# EAGLE schematic TAMDL_V2 (EAGLE 7.3.0)

## Sheet 1 of 6
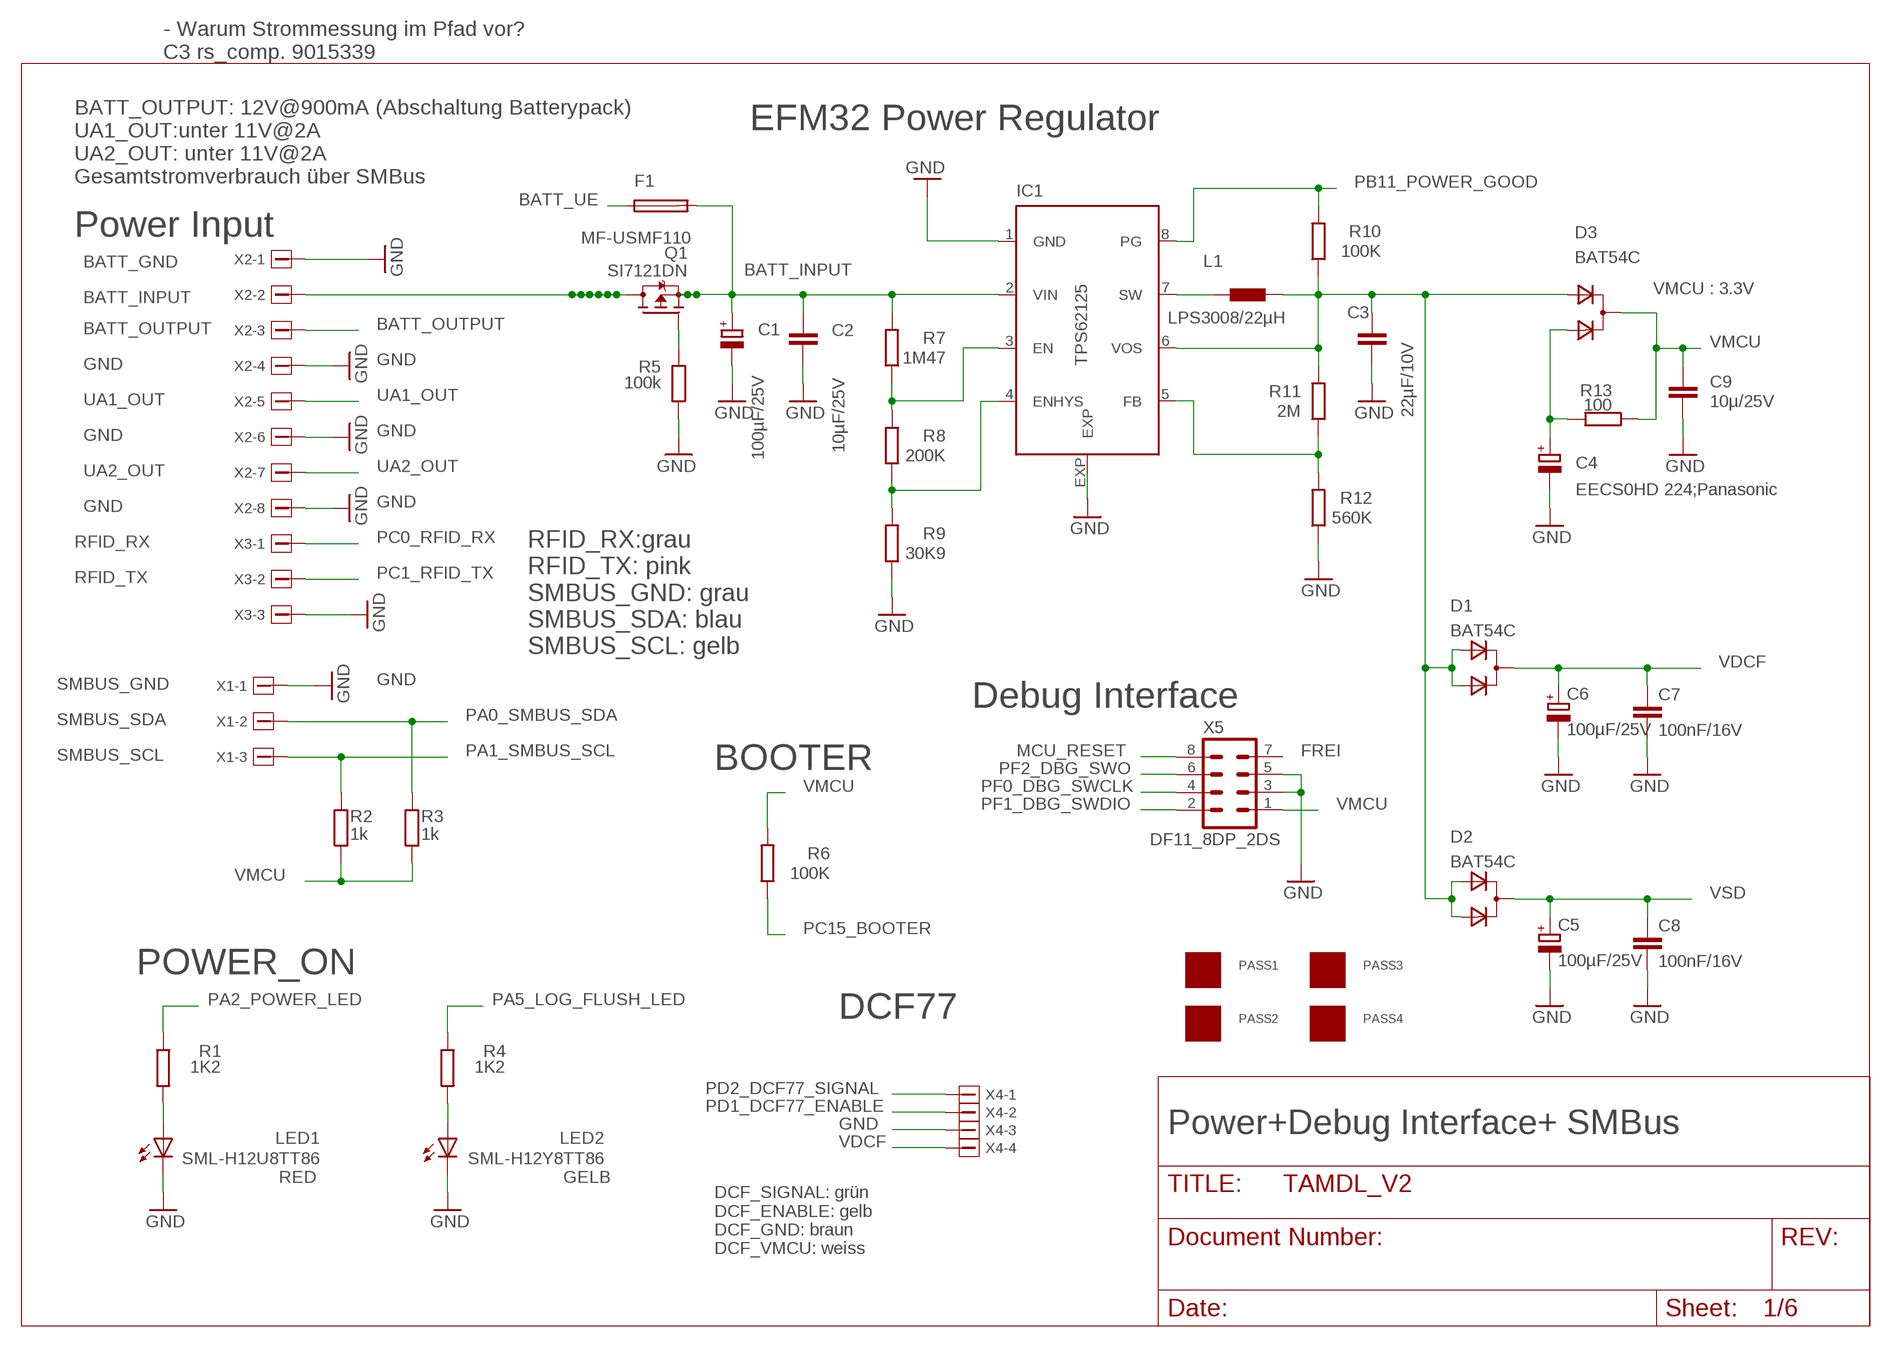
[diagram p0: schematic, sheet 1]

### Parts
C1  100µF/25V  CPOL-EUE  [PANASONIC_E]
C2  10µF/25V  C-EUC1206  [C1206]
C3  22µF/10V  C-EUC0603  [C0603]
C4  EECS0HD 224;Panasonic  GOLDCAPSPK-V  [GOLDCAPSPK-V]
C5  100µF/25V  CPOL-EUE  [PANASONIC_E]
C6  100µF/25V  CPOL-EUE  [PANASONIC_E]
C7  100nF/16V  C-EUC0805  [C0805]
C8  100nF/16V  C-EUC0805  [C0805]
C9  10µ/25V  C-EUC1206  [C1206]
D1  BAT54C  D2A_SOT23  [SOT-23$1]
D2  BAT54C  D2A_SOT23  [SOT-23$1]
D3  BAT54C  D2A_SOT23  [SOT-23$1]
F1  MF-USMF110  PFUF  [PFUF_1210POLY]
IC1  TPS62125  [DSG_PWSO-N8_EXP]
L1  LPS3008/22µH  LPS3008  [LPS3008]
LED1  SML-H12U8TT86  LEDCHIPLED_0805  [CHIPLED_0805]
LED2  SML-H12Y8TT86  LEDCHIPLED_0805  [CHIPLED_0805]
PASS1  ROUND_1MM1.5  [ROUND2_1.5MM]
PASS2  ROUND_1MM1.5  [ROUND2_1.5MM]
PASS3  ROUND_1MM1.5  [ROUND2_1.5MM]
PASS4  ROUND_1MM1.5  [ROUND2_1.5MM]
Q1  SI7121DN  TRANSISTOR-FET_SI7113DN  [TRANSISTOR-FET_1212-8S]
R1  1K2  R-EU_R0805  [R0805]
R2  1k  R-EU_R0805  [R0805]
R3  1k  R-EU_R0805  [R0805]
R4  1K2  R-EU_R0805  [R0805]
R5  100k  R-EU_R0805  [R0805]
R6  100K  R-EU_R0805  [R0805]
R7  1M47  R-EU_R0805  [R0805]
R8  200K  R-EU_R0805  [R0805]
R9  30K9  R-EU_R0805  [R0805]
R10  100K  R-EU_R0805  [R0805]
R11  2M  R-EU_R0805  [R0805]
R12  560K  R-EU_R0805  [R0805]
R13  100  R-EU_R0805  [R0805]
X1  1803439  [1803439]
X2  1803484  [1803484]
X3  1803439  [1803439]
X4  1803442  [1803442]
X5  DF11_8DP_2DS  DP11_8DP_2DS  [DP11_8DP-2DS]

### Nets
1: C3.1 D1.2(A1) D1.3(A2) D2.2(A1) D2.3(A2) D3.2(A1) IC1.6(VOS) L1.2 R10.1 R11.2
BAT+: Q1.5(D) Q1.6(D) Q1.7(D) Q1.8(D) Q1.9(D) Q1.10(D) Q1.11(D) X2.2
BATT_INPUT: C1.+ C2.1 F1.P$2 IC1.2(VIN) Q1.1(S) Q1.2(S) Q1.3(S) R7.2 ; also sheet 4
BATT_OUTPUT: X2.3 ; also sheet 5
BATT_UE: F1.P$1 ; also sheet 5
GND: C1.- C2.2 C3.2 C4.- C5.- C6.- C7.2 C8.2 C9.1 IC1.1(GND) IC1.EXP LED1.C LED2.C R5.1 R9.1 R12.1 X1.1 X2.1 X2.4 X2.6 X2.8 X3.3 X4.3 X5.3 X5.5 ; also sheet 2,3,4,5,6
MCU_RESET: X5.8 ; also sheet 2,3
N$3: LED1.A R1.2
N$4: C4.+ D3.3(A2) R13.2
N$5: LED2.A R4.2
N$6: IC1.3(EN) R7.1 R8.2
N$8: IC1.4(ENHYS) R8.1 R9.2
N$9: IC1.7(SW) L1.1
N$10: IC1.5(FB) R11.1 R12.2
N$20: Q1.4(G) R5.2
PA0_SMBUS_SDA: R3.2 X1.2 ; also sheet 2
PA1_SMBUS_SCL: R2.2 X1.3 ; also sheet 2
PA2_POWER_LED: R1.1 ; also sheet 2
PA5_LOG_FLUSH_LED: R4.1 ; also sheet 2
PB11_POWER_GOOD: IC1.8(PG) R10.2 ; also sheet 2
PC0_RFID_RX: X3.1 ; also sheet 2
PC1_RFID_TX: X3.2 ; also sheet 2
PC15_BOOTER: R6.1 ; also sheet 2
PD1_DCF77_ENABLE: X4.2 ; also sheet 2
PD2_DCF77_SIGNAL: X4.1 ; also sheet 2
PF0_DBG_SWCLK: X5.4 ; also sheet 2
PF1_DBG_SWDIO: X5.2 ; also sheet 2
PF2_DBG_SWO: X5.6 ; also sheet 2
UA1_OUT: X2.5 ; also sheet 4
UA2_OUT: X2.7 ; also sheet 4
VDCF: C6.+ C7.1 D1.1(C) X4.4
VMCU: C9.2 D3.1(C) R2.1 R3.1 R6.2 R13.1 X5.1 ; also sheet 2,3,6
VSD: C5.+ C8.1 D2.1(C) ; also sheet 3
Unconnected: X5.7

### Notes on the sheet
- - Warum Strommessung im Pfad vor?
  C3 rs_comp. 9015339
- EFM32 Power Regulator
- BATT_OUTPUT: 12V@900mA (Abschaltung Batterypack)
  UA1_OUT:unter 11V@2A
  UA2_OUT: unter 11V@2A
  Gesamtstromverbrauch über SMBus
- Power Input
- BATT_GND
- VMCU : 3.3V
- BATT_INPUT
- BATT_OUTPUT
- GND
- UA1_OUT
- GND
- UA2_OUT
- GND
- RFID_RX
- RFID_TX
- RFID_RX:grau
  RFID_TX: pink
  SMBUS_GND: grau
  SMBUS_SDA: blau
  SMBUS_SCL: gelb
- SMBUS_GND
- Debug Interface
- SMBUS_SDA
- SMBUS_SCL | FREI
- BOOTER
- POWER_ON
- DCF77
- Power+Debug Interface+ SMBus
- RED | GELB
- DCF_SIGNAL: grün
  DCF_ENABLE: gelb
  DCF_GND: braun
  DCF_VMCU: weiss

## Sheet 2 of 6
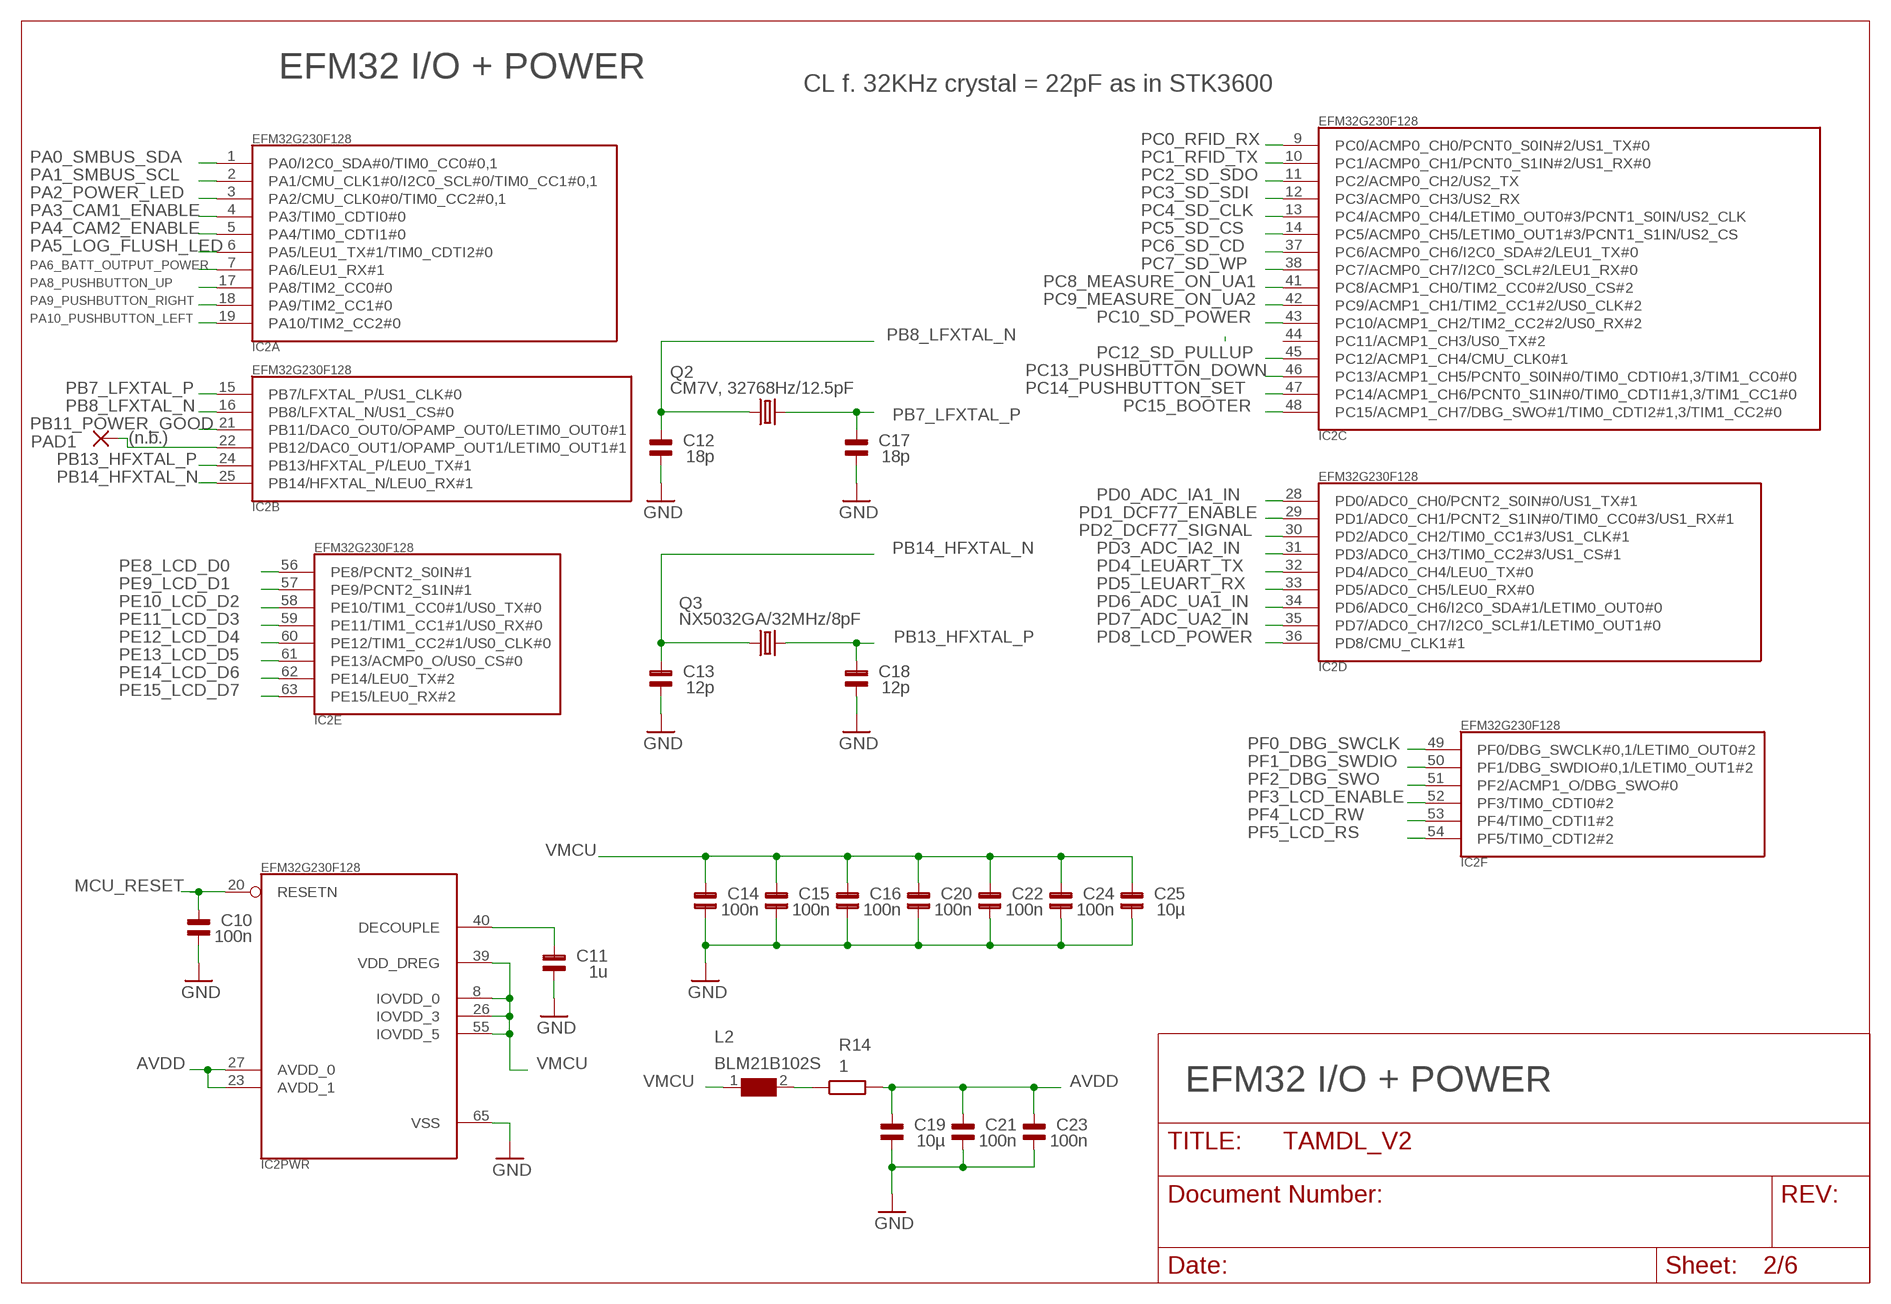
[diagram p1: schematic, sheet 2]

### Parts
C10  100n  C_SMD0805  [0805]
C11  1u  C_SMD0805  [0805]
C12  18p  C_SMD0805  [0805]
C13  12p  C_SMD0805  [0805]
C14  100n  C_SMD0805  [0805]
C15  100n  C_SMD0805  [0805]
C16  100n  C_SMD0805  [0805]
C17  18p  C_SMD0805  [0805]
C18  12p  C_SMD0805  [0805]
C19  10µ  C_SMD0805  [0805]
C20  100n  C_SMD0805  [0805]
C21  100n  C_SMD0805  [0805]
C22  100n  C_SMD0805  [0805]
C23  100n  C_SMD0805  [0805]
C24  100n  C_SMD0805  [0805]
C25  10µ  C_SMD0805  [0805]
IC2  EFM32G230F128  [QFN64]
L2  BLM21B102S  WE-CBF-7427920_0805  [0805]
PAD1  (n.b.)  SMD2  [SMD1,27-2,54]
Q2  CM7V, 32768Hz/12.5pF  CRYSTAL2P  [CRYSTAL2P3.2X1.5]
Q3  NX5032GA/32MHz/8pF  CRYSTAL2P5.0X3.2  [CRYSTAL2P5.0X3.2]
R14  1  R-EU_R0805  [R0805]

### Nets
AVDD [VCC]: C19.2 C21.2 C23.2 IC2.23(PWR:AVDD_1) IC2.27(PWR:AVDD_0) R14.2
GND: C10.1 C11.1 C12.1 C13.1 C14.1 C15.1 C16.1 C17.1 C18.1 C19.1 C20.1 C21.1 C22.1 C23.1 C24.1 C25.1 IC2.65(PWR:VSS) ; also sheet 1,3,4,5,6
MCU_RESET: C10.2 IC2.20(PWR:RESETN) ; also sheet 1,3
N$14: L2.2 R14.1
N$21: IC2.22(B:PB12/DAC0_OUT1/OPAMP_OUT1/LETIM0_OUT1#1) PAD1.1(P)
N$30: C11.2 IC2.40(PWR:DECOUPLE)
PA0_SMBUS_SDA: IC2.1(A:PA0/I2C0_SDA#0/TIM0_CC0#0,1) ; also sheet 1
PA1_SMBUS_SCL: IC2.2(A:PA1/CMU_CLK1#0/I2C0_SCL#0/TIM0_CC1#0,1) ; also sheet 1
PA2_POWER_LED: IC2.3(A:PA2/CMU_CLK0#0/TIM0_CC2#0,1) ; also sheet 1
PA3_CAM1_ENABLE: IC2.4(A:PA3/TIM0_CDTI0#0) ; also sheet 4
PA4_CAM2_ENABLE: IC2.5(A:PA4/TIM0_CDTI1#0) ; also sheet 4
PA5_LOG_FLUSH_LED: IC2.6(A:PA5/LEU1_TX#1/TIM0_CDTI2#0) ; also sheet 1
PA6_BATT_OUTPUT_POWER: IC2.7(A:PA6/LEU1_RX#1) ; also sheet 5
PA8_PUSHBUTTON_UP: IC2.17(A:PA8/TIM2_CC0#0) ; also sheet 3
PA9_PUSHBUTTON_RIGHT: IC2.18(A:PA9/TIM2_CC1#0) ; also sheet 3
PA10_PUSHBUTTON_LEFT: IC2.19(A:PA10/TIM2_CC2#0) ; also sheet 3
PB7_LFXTAL_P: C17.2 IC2.15(B:PB7/LFXTAL_P/US1_CLK#0) Q2.2
PB8_LFXTAL_N: C12.2 IC2.16(B:PB8/LFXTAL_N/US1_CS#0) Q2.1
PB11_POWER_GOOD: IC2.21(B:PB11/DAC0_OUT0/OPAMP_OUT0/LETIM0_OUT0#1) ; also sheet 1
PB13_HFXTAL_P: C18.2 IC2.24(B:PB13/HFXTAL_P/LEU0_TX#1) Q3.2
PB14_HFXTAL_N: C13.2 IC2.25(B:PB14/HFXTAL_N/LEU0_RX#1) Q3.1
PC0_RFID_RX: IC2.9(C:PC0/ACMP0_CH0/PCNT0_S0IN#2/US1_TX#0) ; also sheet 1
PC1_RFID_TX: IC2.10(C:PC1/ACMP0_CH1/PCNT0_S1IN#2/US1_RX#0) ; also sheet 1
PC2_SD_SDO: IC2.11(C:PC2/ACMP0_CH2/US2_TX) ; also sheet 3
PC3_SD_SDI: IC2.12(C:PC3/ACMP0_CH3/US2_RX) ; also sheet 3
PC4_SD_CLK: IC2.13(C:PC4/ACMP0_CH4/LETIM0_OUT0#3/PCNT1_S0IN/US2_CLK) ; also sheet 3
PC5_SD_CS: IC2.14(C:PC5/ACMP0_CH5/LETIM0_OUT1#3/PCNT1_S1IN/US2_CS) ; also sheet 3
PC6_SD_CD: IC2.37(C:PC6/ACMP0_CH6/I2C0_SDA#2/LEU1_TX#0) ; also sheet 3
PC7_SD_WP: IC2.38(C:PC7/ACMP0_CH7/I2C0_SCL#2/LEU1_RX#0) ; also sheet 3
PC8_MEASURE_ON_UA1: IC2.41(C:PC8/ACMP1_CH0/TIM2_CC0#2/US0_CS#2) ; also sheet 5
PC9_MEASURE_ON_UA2: IC2.42(C:PC9/ACMP1_CH1/TIM2_CC1#2/US0_CLK#2) ; also sheet 5
PC10_SD_POWER: IC2.43(C:PC10/ACMP1_CH2/TIM2_CC2#2/US0_RX#2) ; also sheet 3
PC12_SD_PULLUP: IC2.45(C:PC12/ACMP1_CH4/CMU_CLK0#1) ; also sheet 3
PC13_PUSHBUTTON_DOWN: IC2.46(C:PC13/ACMP1_CH5/PCNT0_S0IN#0/TIM0_CDTI0#1,3/TIM1_CC0#0) ; also sheet 3
PC14_PUSHBUTTON_SET: IC2.47(C:PC14/ACMP1_CH6/PCNT0_S1IN#0/TIM0_CDTI1#1,3/TIM1_CC1#0) ; also sheet 3
PC15_BOOTER: IC2.48(C:PC15/ACMP1_CH7/DBG_SWO#1/TIM0_CDTI2#1,3/TIM1_CC2#0) ; also sheet 1
PD0_ADC_IA1_IN: IC2.28(D:PD0/ADC0_CH0/PCNT2_S0IN#0/US1_TX#1) ; also sheet 5
PD1_DCF77_ENABLE: IC2.29(D:PD1/ADC0_CH1/PCNT2_S1IN#0/TIM0_CC0#3/US1_RX#1) ; also sheet 1
PD2_DCF77_SIGNAL: IC2.30(D:PD2/ADC0_CH2/TIM0_CC1#3/US1_CLK#1) ; also sheet 1
PD3_ADC_IA2_IN: IC2.31(D:PD3/ADC0_CH3/TIM0_CC2#3/US1_CS#1) ; also sheet 5
PD4_LEUART_TX: IC2.32(D:PD4/ADC0_CH4/LEU0_TX#0) ; also sheet 3
PD5_LEUART_RX: IC2.33(D:PD5/ADC0_CH5/LEU0_RX#0) ; also sheet 3
PD6_ADC_UA1_IN: IC2.34(D:PD6/ADC0_CH6/I2C0_SDA#1/LETIM0_OUT0#0) ; also sheet 5
PD7_ADC_UA2_IN: IC2.35(D:PD7/ADC0_CH7/I2C0_SCL#1/LETIM0_OUT1#0) ; also sheet 5
PD8_LCD_POWER: IC2.36(D:PD8/CMU_CLK1#1) ; also sheet 6
PE8_LCD_D0: IC2.56(E:PE8/PCNT2_S0IN#1) ; also sheet 6
PE9_LCD_D1: IC2.57(E:PE9/PCNT2_S1IN#1) ; also sheet 6
PE10_LCD_D2: IC2.58(E:PE10/TIM1_CC0#1/US0_TX#0) ; also sheet 6
PE11_LCD_D3: IC2.59(E:PE11/TIM1_CC1#1/US0_RX#0) ; also sheet 6
PE12_LCD_D4: IC2.60(E:PE12/TIM1_CC2#1/US0_CLK#0) ; also sheet 6
PE13_LCD_D5: IC2.61(E:PE13/ACMP0_O/US0_CS#0) ; also sheet 6
PE14_LCD_D6: IC2.62(E:PE14/LEU0_TX#2) ; also sheet 6
PE15_LCD_D7: IC2.63(E:PE15/LEU0_RX#2) ; also sheet 6
PF0_DBG_SWCLK: IC2.49(F:PF0/DBG_SWCLK#0,1/LETIM0_OUT0#2) ; also sheet 1
PF1_DBG_SWDIO: IC2.50(F:PF1/DBG_SWDIO#0,1/LETIM0_OUT1#2) ; also sheet 1
PF2_DBG_SWO: IC2.51(F:PF2/ACMP1_O/DBG_SWO#0) ; also sheet 1
PF3_LCD_ENABLE: IC2.52(F:PF3/TIM0_CDTI0#2) ; also sheet 6
PF4_LCD_RW: IC2.53(F:PF4/TIM0_CDTI1#2) ; also sheet 6
PF5_LCD_RS: IC2.54(F:PF5/TIM0_CDTI2#2) ; also sheet 6
VMCU: C14.2 C15.2 C16.2 C20.2 C22.2 C24.2 C25.2 IC2.8(PWR:IOVDD_0) IC2.26(PWR:IOVDD_3) IC2.39(PWR:VDD_DREG) IC2.55(PWR:IOVDD_5) L2.1 ; also sheet 1,3,6
Unconnected: IC2.44(C:PC11/ACMP1_CH3/US0_TX#2)

### Notes on the sheet
- EFM32 I/O + POWER
- CL f. 32KHz crystal = 22pF as in STK3600
- EFM32 I/O + POWER

## Sheet 3 of 6
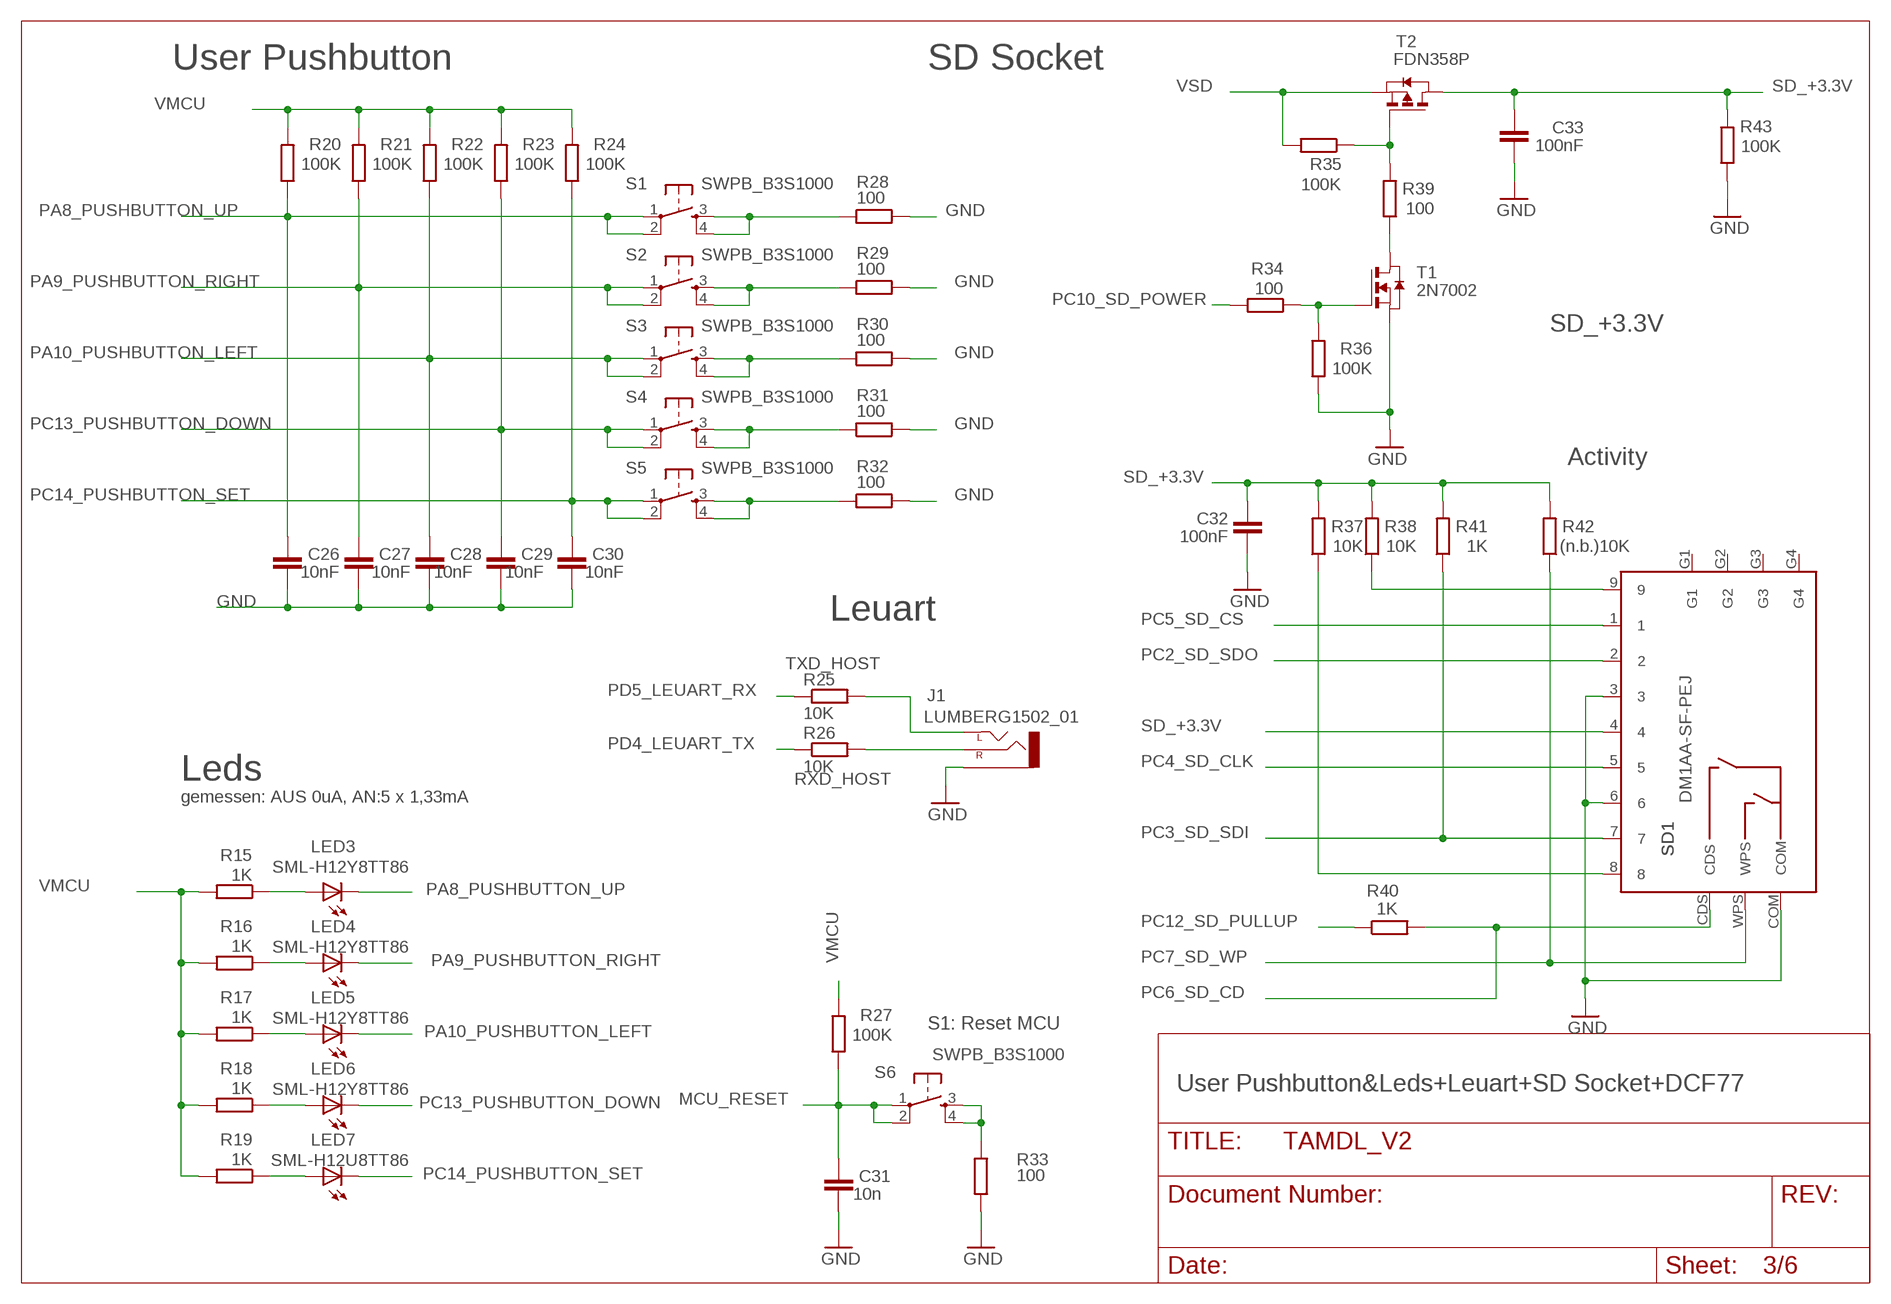
[diagram p2: schematic, sheet 3]

### Parts
C26  10nF  C-EUC0603  [C0603]
C27  10nF  C-EUC0603  [C0603]
C28  10nF  C-EUC0603  [C0603]
C29  10nF  C-EUC0603  [C0603]
C30  10nF  C-EUC0603  [C0603]
C31  10n  C-EUC0603  [C0603]
C32  100nF  C-EUC0603  [C0603]
C33  100nF  C-EUC0603  [C0603]
J1  LUMBERG1502_01  [LUMBERG1502_01]
LED3  SML-H12Y8TT86  LEDCHIPLED_0805  [CHIPLED_0805]
LED4  SML-H12Y8TT86  LEDCHIPLED_0805  [CHIPLED_0805]
LED5  SML-H12Y8TT86  LEDCHIPLED_0805  [CHIPLED_0805]
LED6  SML-H12Y8TT86  LEDCHIPLED_0805  [CHIPLED_0805]
LED7  SML-H12U8TT86  LEDCHIPLED_0805  [CHIPLED_0805]
R15  1K  R-EU_R0805  [R0805]
R16  1K  R-EU_R0805  [R0805]
R17  1K  R-EU_R0805  [R0805]
R18  1K  R-EU_R0805  [R0805]
R19  1K  R-EU_R0805  [R0805]
R20  100K  R-EU_R0805  [R0805]
R21  100K  R-EU_R0805  [R0805]
R22  100K  R-EU_R0805  [R0805]
R23  100K  R-EU_R0805  [R0805]
R24  100K  R-EU_R0805  [R0805]
R25  10K  R-EU_R0805  [R0805]
R26  10K  R-EU_R0805  [R0805]
R27  100K  R-EU_R0805  [R0805]
R28  100  R-EU_R0805  [R0805]
R29  100  R-EU_R0805  [R0805]
R30  100  R-EU_R0805  [R0805]
R31  100  R-EU_R0805  [R0805]
R32  100  R-EU_R0805  [R0805]
R33  100  R-EU_R0805  [R0805]
R34  100  R-EU_R0805  [R0805]
R35  100K  R-EU_R0805  [R0805]
R36  100K  R-EU_R0805  [R0805]
R37  10K  R-EU_R0805  [R0805]
R38  10K  R-EU_R0805  [R0805]
R39  100  R-EU_R0805  [R0805]
R40  1K  R-EU_R0805  [R0805]
R41  1K  R-EU_R0805  [R0805]
R42  (n.b.)10K  R-EU_R0805  [R0805]
R43  100K  R-EU_R0805  [R0805]
S1  SWPB_B3S1000  DTSM-6  [DTSM-6]
S2  SWPB_B3S1000  DTSM-6  [DTSM-6]
S3  SWPB_B3S1000  DTSM-6  [DTSM-6]
S4  SWPB_B3S1000  DTSM-6  [DTSM-6]
S5  SWPB_B3S1000  DTSM-6  [DTSM-6]
S6  SWPB_B3S1000  DTSM-6  [DTSM-6]
SD1  DM1AA-SF-PEJ  [DM1AA-SF-PEJ]
T1  2N7002  ZETEX_NMOSSOT23  [ZETEX_SOT-23]
T2  FDN358P  ZETEX_PMOSSOT23  [ZETEX_SOT-23]

### Nets
GND: C26.1 C27.1 C28.1 C29.1 C30.1 C31.1 C32.2 C33.2 J1.P$1(1-SLEEVE) R28.2 R29.2 R30.2 R31.2 R32.2 R33.2 R36.1 R43.1 SD1.3 SD1.6 SD1.COM T1.2(S) ; also sheet 1,2,4,5,6
MCU_RESET: C31.2 R27.1 S6.1 S6.2 ; also sheet 1,2
N$1: R33.1 S6.3 S6.4
N$12: R38.1 SD1.9
N$13: R37.1 SD1.8
N$22: LED3.A R15.1
N$23: R28.1 S1.3 S1.4
N$24: R29.1 S2.3 S2.4
N$26: R30.1 S3.3 S3.4
N$27: R31.1 S4.3 S4.4
N$28: R32.1 S5.3 S5.4
N$29: LED4.A R16.1
N$41: R35.1 R39.2 T2.3(G)
N$43: R39.1 T1.1(D)
N$47: R34.1 R36.2 T1.3(G)
N$52: LED5.A R17.1
N$68: LED6.A R18.1
N$71: LED7.A R19.1
PA8_PUSHBUTTON_UP: C26.2 LED3.C R20.1 S1.1 S1.2 ; also sheet 2
PA9_PUSHBUTTON_RIGHT: C27.2 LED4.C R21.1 S2.1 S2.2 ; also sheet 2
PA10_PUSHBUTTON_LEFT: C28.2 LED5.C R22.1 S3.1 S3.2 ; also sheet 2
PC2_SD_SDO: SD1.2 ; also sheet 2
PC3_SD_SDI: R41.1 SD1.7 ; also sheet 2
PC4_SD_CLK: SD1.5 ; also sheet 2
PC5_SD_CS: SD1.1 ; also sheet 2
PC6_SD_CD: R40.2 SD1.CDS ; also sheet 2
PC7_SD_WP: R42.1 SD1.WPS ; also sheet 2
PC10_SD_POWER: R34.2 ; also sheet 2
PC12_SD_PULLUP: R40.1 ; also sheet 2
PC13_PUSHBUTTON_DOWN: C29.2 LED6.C R23.1 S4.1 S4.2 ; also sheet 2
PC14_PUSHBUTTON_SET: C30.2 LED7.C R24.1 S5.1 S5.2 ; also sheet 2
PD4_LEUART_TX: R26.1 ; also sheet 2
PD5_LEUART_RX: R25.1 ; also sheet 2
RXD_HOST: J1.P$3(3-RIGHT) R26.2
SD_+3.3V: C32.1 C33.1 R37.2 R38.2 R41.2 R42.2 R43.2 SD1.4 T2.1(D)
TXD_HOST: J1.P$2(2-LEFT) R25.2
VMCU: R15.2 R16.2 R17.2 R18.2 R19.2 R20.2 R21.2 R22.2 R23.2 R24.2 R27.2 ; also sheet 1,2,6
VSD: R35.2 T2.2(S) ; also sheet 1
Unconnected: SD1.G1 SD1.G2 SD1.G3 SD1.G4

### Notes on the sheet
- User Pushbutton | SD Socket
- SD_+3.3V
- Activity
- Leuart
- Leds
- gemessen: AUS 0uA, AN:5 x 1,33mA
- S1: Reset MCU
- User Pushbutton&Leds+Leuart+SD Socket+DCF77

## Sheet 4 of 6
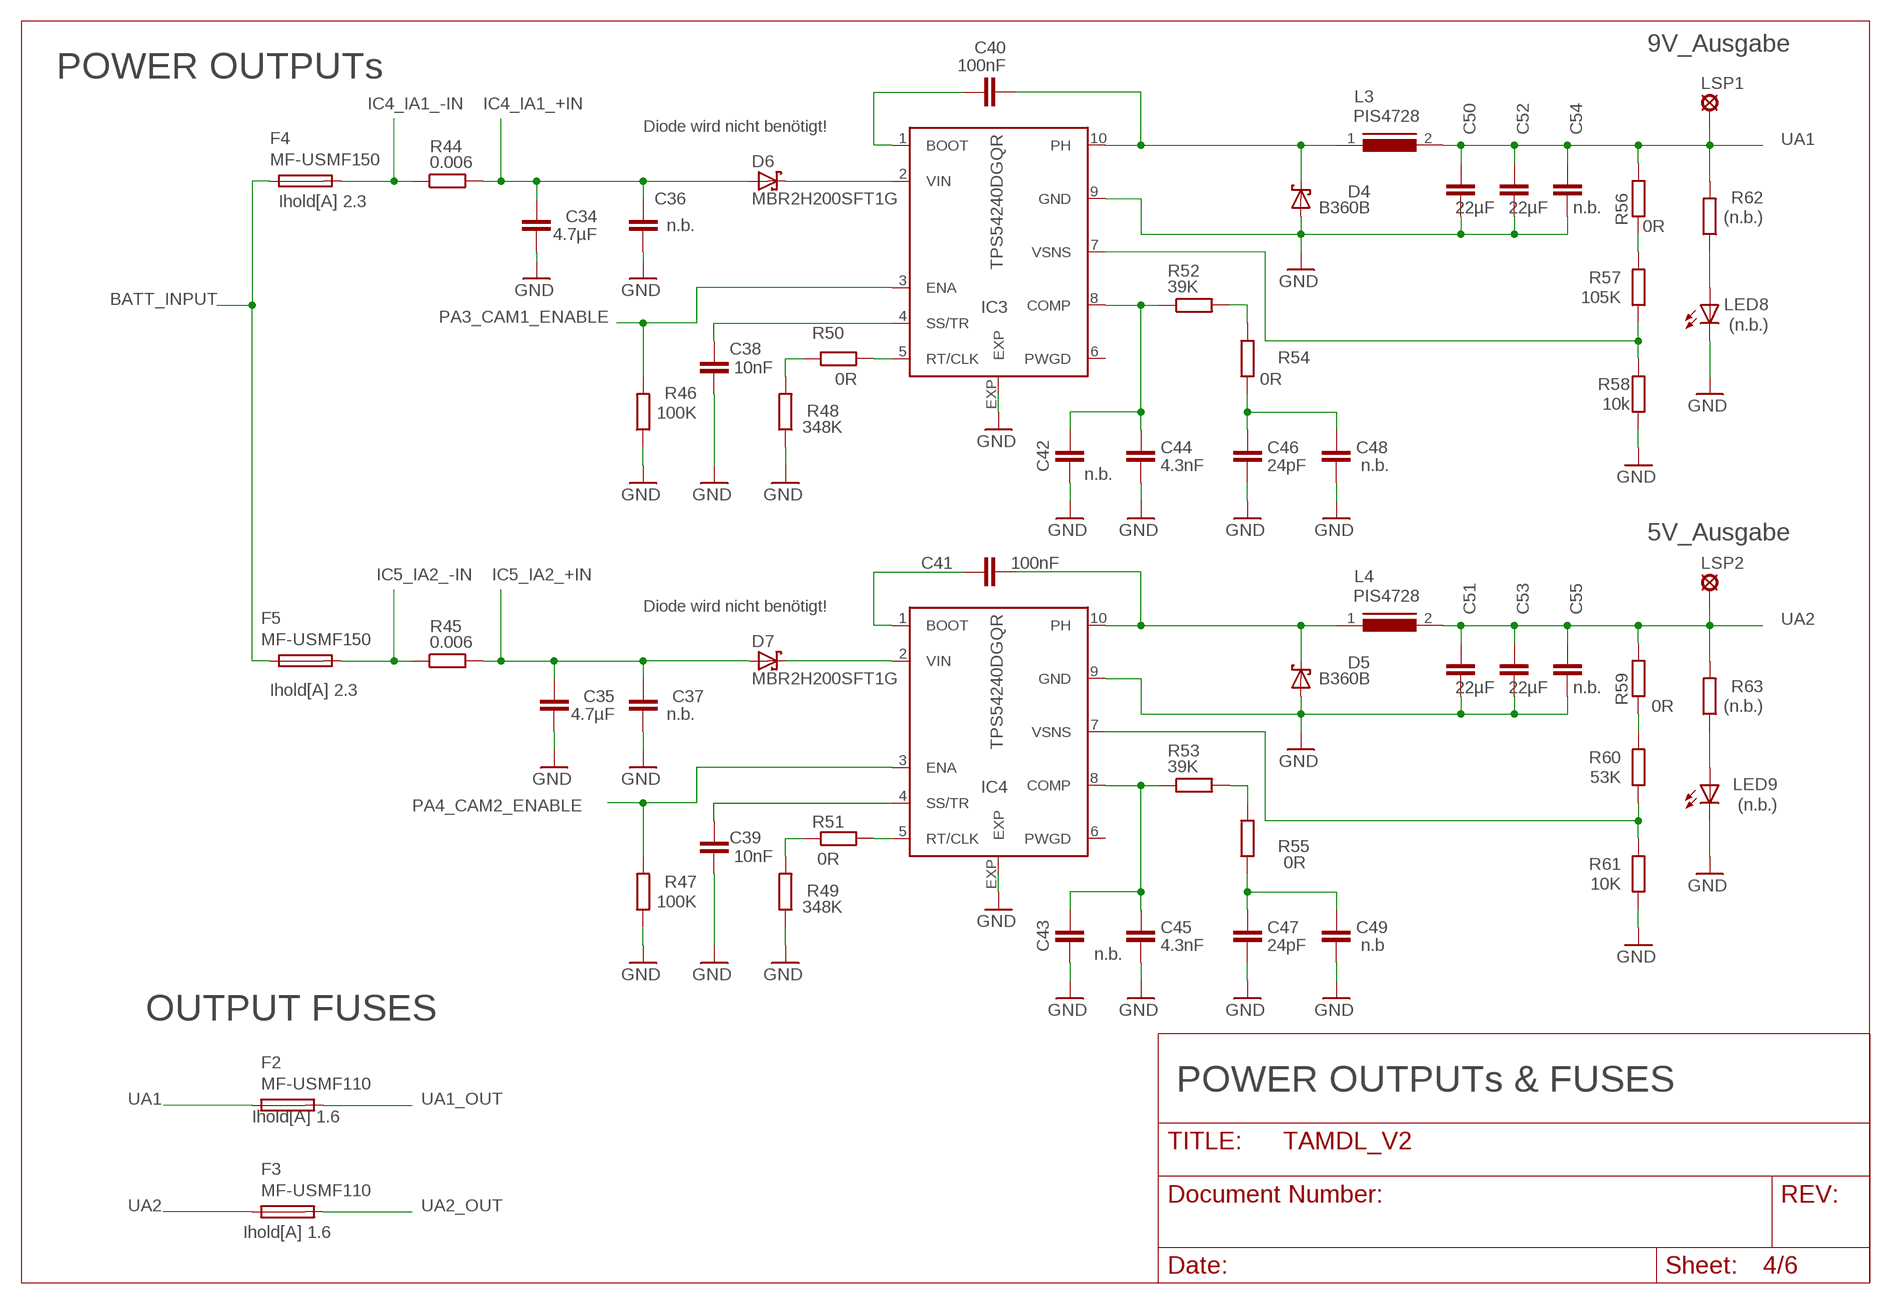
[diagram p3: schematic, sheet 4]

### Parts
C34  4.7µF  C-EUC1210  [C1210]
C35  4.7µF  C-EUC1210  [C1210]
C36  n.b.  C-EUC1210  [C1210]
C37  n.b.  C-EUC1210  [C1210]
C38  10nF  C-EUC0603  [C0603]
C39  10nF  C-EUC0603  [C0603]
C40  100nF  C-EUC0603  [C0603]
C41  100nF  C-EUC0603  [C0603]
C42  n.b.  C-EUC0603  [C0603]
C43  n.b.  C-EUC0603  [C0603]
C44  4.3nF  C-EUC0603  [C0603]
C45  4.3nF  C-EUC0603  [C0603]
C46  24pF  C-EUC0603  [C0603]
C47  24pF  C-EUC0603  [C0603]
C48  n.b.  C-EUC0603  [C0603]
C49  n.b  C-EUC0603  [C0603]
C50  22µF  C-EUC1210  [C1210]
C51  22µF  C-EUC1210  [C1210]
C52  22µF  C-EUC1210  [C1210]
C53  22µF  C-EUC1210  [C1210]
C54  n.b.  C-EUC1210  [C1210]
C55  n.b.  C-EUC1210  [C1210]
D4  B360B  SCHOTTKY-DIODESMD  [SMB]
D5  B360B  SCHOTTKY-DIODESMD  [SMB]
D6  MBR2H200SFT1G  SMF5.0AT1  [SOD123FL]
D7  MBR2H200SFT1G  SMF5.0AT1  [SOD123FL]
F2  MF-USMF110  PFUF  [PFUF_1210POLY]
F3  MF-USMF110  PFUF  [PFUF_1210POLY]
F4  MF-USMF150  PFUF  [PFUF_1210POLY]
F5  MF-USMF150  PFUF  [PFUF_1210POLY]
IC3  TPS54240DGQR  [S-PDSO-G10]
IC4  TPS54240DGQR  [S-PDSO-G10]
L3  PIS4728  DR127  [DR127]
L4  PIS4728  DR127  [DR127]
LED8  (n.b.)  LEDCHIPLED_0805  [CHIPLED_0805]
LED9  (n.b.)  LEDCHIPLED_0805  [CHIPLED_0805]
LSP1  (n.b.)SE13  SE13  [SE13]
LSP2  (n.b.)SE13  SE13  [SE13]
R44  0.006  R-EU_R2512W  [R2512W]
R45  0.006  R-EU_R2512W  [R2512W]
R46  100K  R-EU_R0805  [R0805]
R47  100K  R-EU_R0805  [R0805]
R48  348K  R-EU_R0805  [R0805]
R49  348K  R-EU_R0805  [R0805]
R50  0R  R-EU_R0805  [R0805]
R51  0R  R-EU_R0805  [R0805]
R52  39K  R-EU_R0805  [R0805]
R53  39K  R-EU_R0805  [R0805]
R54  0R  R-EU_R0805  [R0805]
R55  0R  R-EU_R0805  [R0805]
R56  0R  R-EU_R0805  [R0805]
R57  105K  R-EU_R0805  [R0805]
R58  10k  R-EU_R0805  [R0805]
R59  0R  R-EU_R0805  [R0805]
R60  53K  R-EU_R0805  [R0805]
R61  10K  R-EU_R0805  [R0805]
R62  (n.b.)  R-EU_R0805  [R0805]
R63  (n.b.)  R-EU_R0805  [R0805]

### Nets
BATT_INPUT: F4.P$1 F5.P$1 ; also sheet 1
GND: C34.2 C35.2 C36.2 C37.2 C38.2 C39.2 C42.2 C43.2 C44.2 C45.2 C46.2 C47.2 C48.2 C49.2 C50.2 C51.2 C52.2 C53.2 C54.2 C55.2 D4.A D5.A IC3.9(GND) IC3.EXP IC4.9(GND) IC4.EXP LED8.C LED9.C R46.1 R47.1 R48.1 R49.1 R58.1 R61.1 ; also sheet 1,2,3,5,6
IC4_IA1_+IN: C34.1 C36.1 D6.A R44.2 ; also sheet 5
IC4_IA1_-IN: F4.P$2 R44.1 ; also sheet 5
IC5_IA2_+IN: C35.1 C37.1 D7.A R45.2 ; also sheet 5
IC5_IA2_-IN: F5.P$2 R45.1 ; also sheet 5
N$2: C40.2 IC3.1(BOOT)
N$7: C40.1 D4.C IC3.10(PH) L3.1
N$15: C38.1 IC3.4(SS/TR)
N$16: C42.1 C44.1 IC3.8(COMP) R52.1
N$36: C46.1 C48.1 R54.1
N$38: IC3.7(VSNS) R57.1 R58.2
N$42: C41.2 IC4.1(BOOT)
N$45: C41.1 D5.C IC4.10(PH) L4.1
N$55: C39.1 IC4.4(SS/TR)
N$56: C43.1 C45.1 IC4.8(COMP) R53.1
N$57: C47.1 C49.1 R55.1
N$58: IC4.7(VSNS) R60.1 R61.2
N$59: LED9.A R63.1
N$61: R48.2 R50.1
N$62: D6.C IC3.2(VIN)
N$63: R49.2 R51.1
N$64: IC3.5(RT/CLK) R50.2
N$65: R52.2 R54.2
N$66: R56.1 R57.2
N$67: IC4.5(RT/CLK) R51.2
N$69: R59.1 R60.2
N$70: R53.2 R55.2
N$72: D7.C IC4.2(VIN)
N$73: LED8.A R62.1
PA3_CAM1_ENABLE: IC3.3(ENA) R46.2 ; also sheet 2
PA4_CAM2_ENABLE: IC4.3(ENA) R47.2 ; also sheet 2
UA1: C50.1 C52.1 C54.1 F2.P$1 L3.2 LSP1.MP R56.2 R62.2 ; also sheet 5
UA1_OUT: F2.P$2 ; also sheet 1
UA2: C51.1 C53.1 C55.1 F3.P$1 L4.2 LSP2.MP R59.2 R63.2 ; also sheet 5
UA2_OUT: F3.P$2 ; also sheet 1
Unconnected: IC3.6(PWGD) IC4.6(PWGD)

### Notes on the sheet
- 9V_Ausgabe
- POWER OUTPUTs
- Diode wird nicht benötigt!
- Ihold[A] 2.3
- 5V_Ausgabe
- Diode wird nicht benötigt!
- Ihold[A] 2.3
- OUTPUT FUSES
- POWER OUTPUTs & FUSES
- Ihold[A] 1.6
- Ihold[A] 1.6

## Sheet 5 of 6
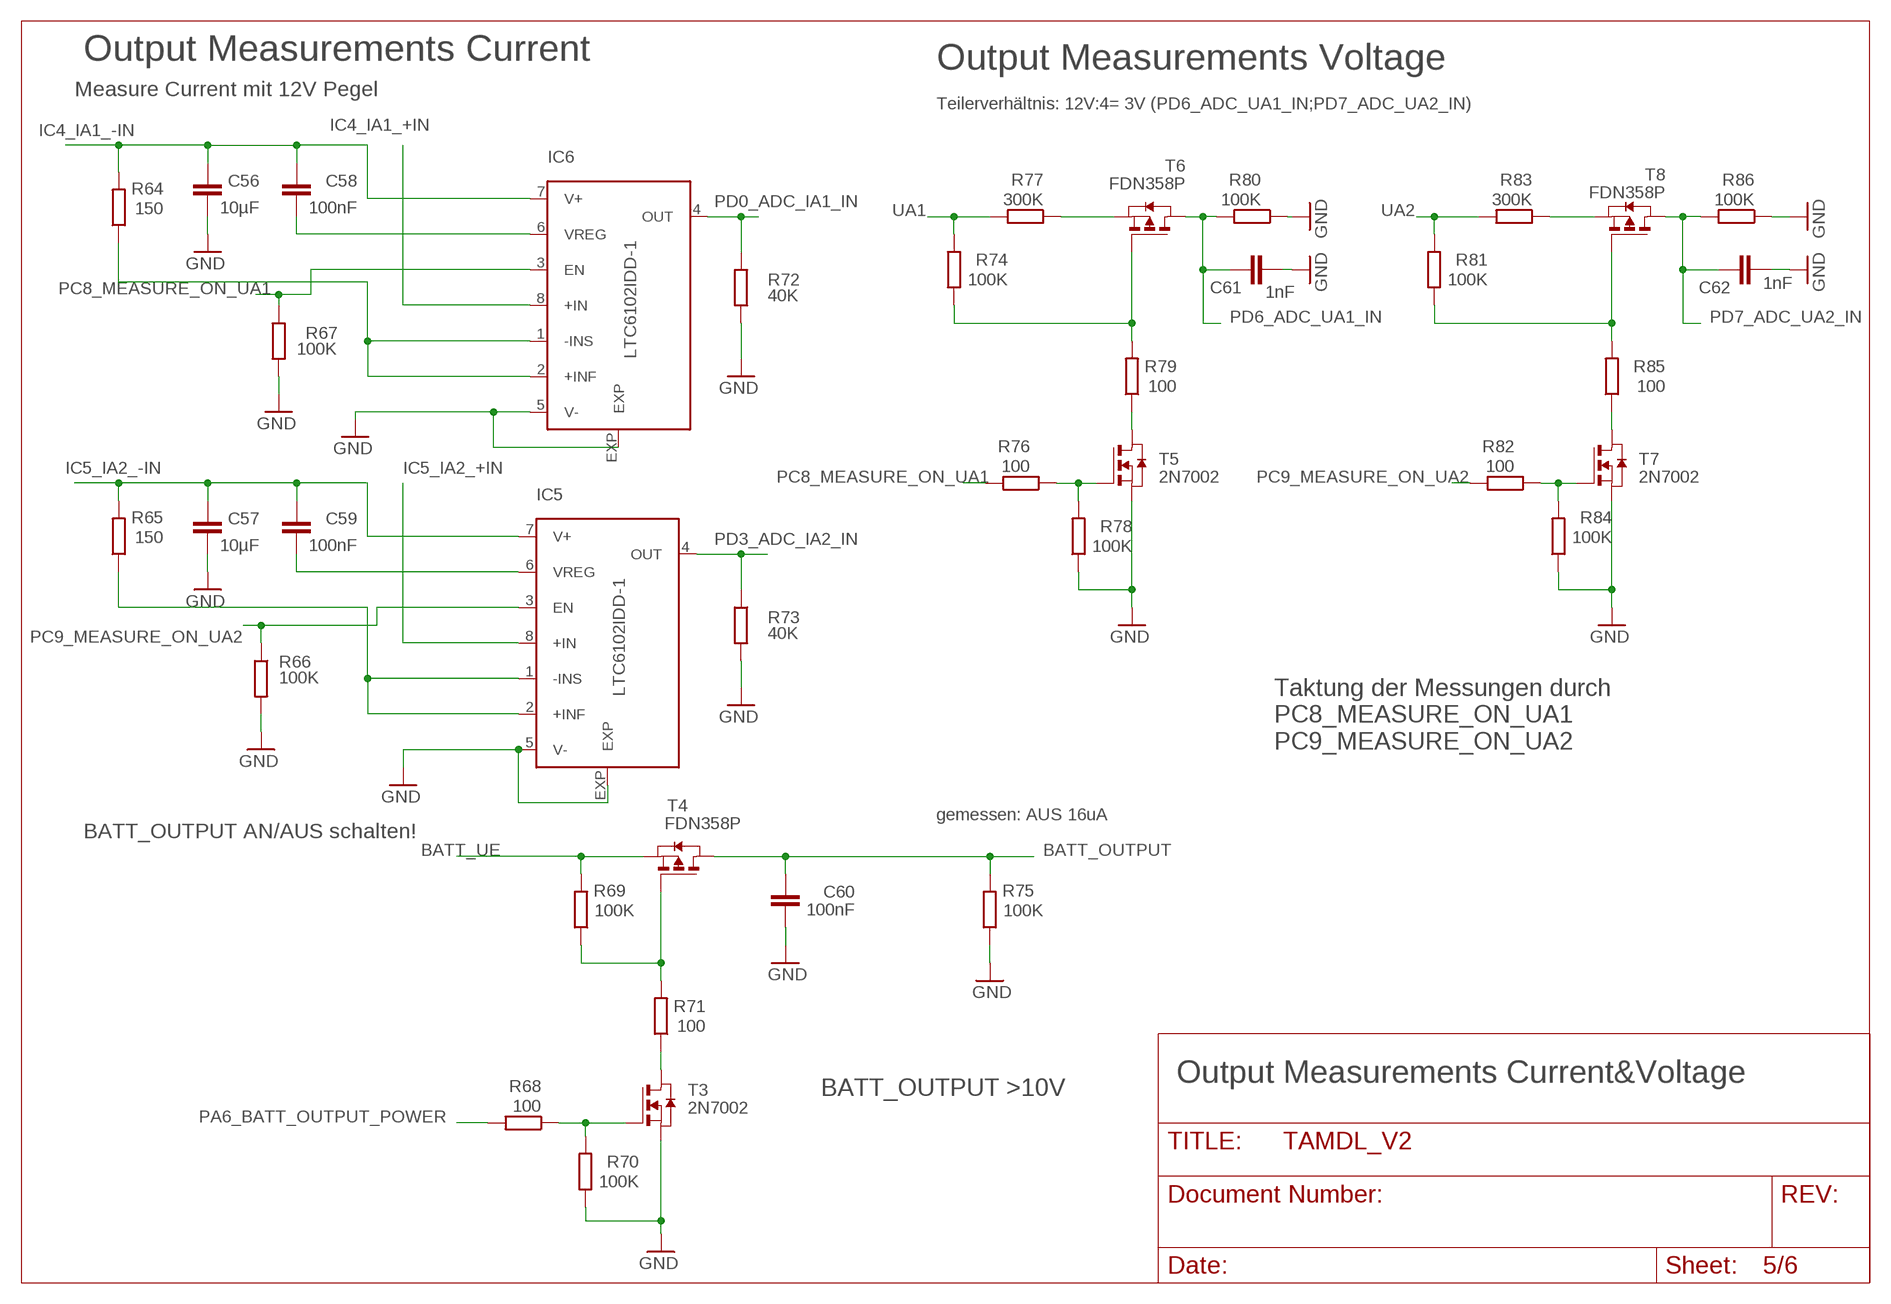
[diagram p4: schematic, sheet 5]

### Parts
C56  10µF  C-EUC1206  [C1206]
C57  10µF  C-EUC1206  [C1206]
C58  100nF  C-EUC0603  [C0603]
C59  100nF  C-EUC0603  [C0603]
C60  100nF  C-EUC0603  [C0603]
C61  1nF  C-EUC0603  [C0603]
C62  1nF  C-EUC0603  [C0603]
IC5  LTC6102IDD-1  [DFN8-LEAD]
IC6  LTC6102IDD-1  [DFN8-LEAD]
R64  150  R-EU_R0805  [R0805]
R65  150  R-EU_R0805  [R0805]
R66  100K  R-EU_R0805  [R0805]
R67  100K  R-EU_R0805  [R0805]
R68  100  R-EU_R0805  [R0805]
R69  100K  R-EU_R0805  [R0805]
R70  100K  R-EU_R0805  [R0805]
R71  100  R-EU_R0805  [R0805]
R72  40K  R-EU_R0805  [R0805]
R73  40K  R-EU_R0805  [R0805]
R74  100K  R-EU_R0805  [R0805]
R75  100K  R-EU_R0805  [R0805]
R76  100  R-EU_R0805  [R0805]
R77  300K  R-EU_R0805  [R0805]
R78  100K  R-EU_R0805  [R0805]
R79  100  R-EU_R0805  [R0805]
R80  100K  R-EU_R0805  [R0805]
R81  100K  R-EU_R0805  [R0805]
R82  100  R-EU_R0805  [R0805]
R83  300K  R-EU_R0805  [R0805]
R84  100K  R-EU_R0805  [R0805]
R85  100  R-EU_R0805  [R0805]
R86  100K  R-EU_R0805  [R0805]
T3  2N7002  ZETEX_NMOSSOT23  [ZETEX_SOT-23]
T4  FDN358P  ZETEX_PMOSSOT23  [ZETEX_SOT-23]
T5  2N7002  ZETEX_NMOSSOT23  [ZETEX_SOT-23]
T6  FDN358P  ZETEX_PMOSSOT23  [ZETEX_SOT-23]
T7  2N7002  ZETEX_NMOSSOT23  [ZETEX_SOT-23]
T8  FDN358P  ZETEX_PMOSSOT23  [ZETEX_SOT-23]

### Nets
BATT_OUTPUT: C60.1 R75.2 T4.1(D) ; also sheet 1
BATT_UE: R69.2 T4.2(S) ; also sheet 1
GND: C56.1 C57.1 C60.2 C61.2 C62.2 IC5.5(V-) IC5.EXP IC6.5(V-) IC6.EXP R66.2 R67.2 R70.1 R72.2 R73.2 R75.1 R78.1 R80.1 R84.1 R86.1 T3.2(S) T5.2(S) T7.2(S) ; also sheet 1,2,3,4,6
IC4_IA1_+IN: IC6.8(+IN) ; also sheet 4
IC4_IA1_-IN: C56.2 C58.2 IC6.7(V+) R64.2 ; also sheet 4
IC5_IA2_+IN: IC5.8(+IN) ; also sheet 4
IC5_IA2_-IN: C57.2 C59.2 IC5.7(V+) R65.2 ; also sheet 4
N$11: R69.1 R71.2 T4.3(G)
N$17: R71.1 T3.1(D)
N$18: R68.1 R70.2 T3.3(G)
N$19: R74.1 R79.2 T6.3(G)
N$25: IC6.1(-INS) IC6.2(+INF) R64.1
N$33: C58.1 IC6.6(VREG)
N$40: IC5.1(-INS) IC5.2(+INF) R65.1
N$44: C59.1 IC5.6(VREG)
N$46: R79.1 T5.1(D)
N$48: R76.1 R78.2 T5.3(G)
N$49: R81.1 R85.2 T8.3(G)
N$50: R85.1 T7.1(D)
N$51: R82.1 R84.2 T7.3(G)
N$53: R77.1 T6.2(S)
N$54: R83.1 T8.2(S)
PA6_BATT_OUTPUT_POWER: R68.2 ; also sheet 2
PC8_MEASURE_ON_UA1: IC6.3(EN) R67.1 R76.2 ; also sheet 2
PC9_MEASURE_ON_UA2: IC5.3(EN) R66.1 R82.2 ; also sheet 2
PD0_ADC_IA1_IN: IC6.4(OUT) R72.1 ; also sheet 2
PD3_ADC_IA2_IN: IC5.4(OUT) R73.1 ; also sheet 2
PD6_ADC_UA1_IN: C61.1 R80.2 T6.1(D) ; also sheet 2
PD7_ADC_UA2_IN: C62.1 R86.2 T8.1(D) ; also sheet 2
UA1: R74.2 R77.2 ; also sheet 4
UA2: R81.2 R83.2 ; also sheet 4

### Notes on the sheet
- Output Measurements Current | Output Measurements Voltage
- Measure Current mit 12V Pegel
- Teilerverhältnis: 12V:4= 3V (PD6_ADC_UA1_IN;PD7_ADC_UA2_IN)
- Taktung der Messungen durch 
  PC8_MEASURE_ON_UA1
  PC9_MEASURE_ON_UA2
- gemessen: AUS 16uA
- BATT_OUTPUT AN/AUS schalten!
- Output Measurements Current&Voltage
- BATT_OUTPUT >10V

## Sheet 6 of 6
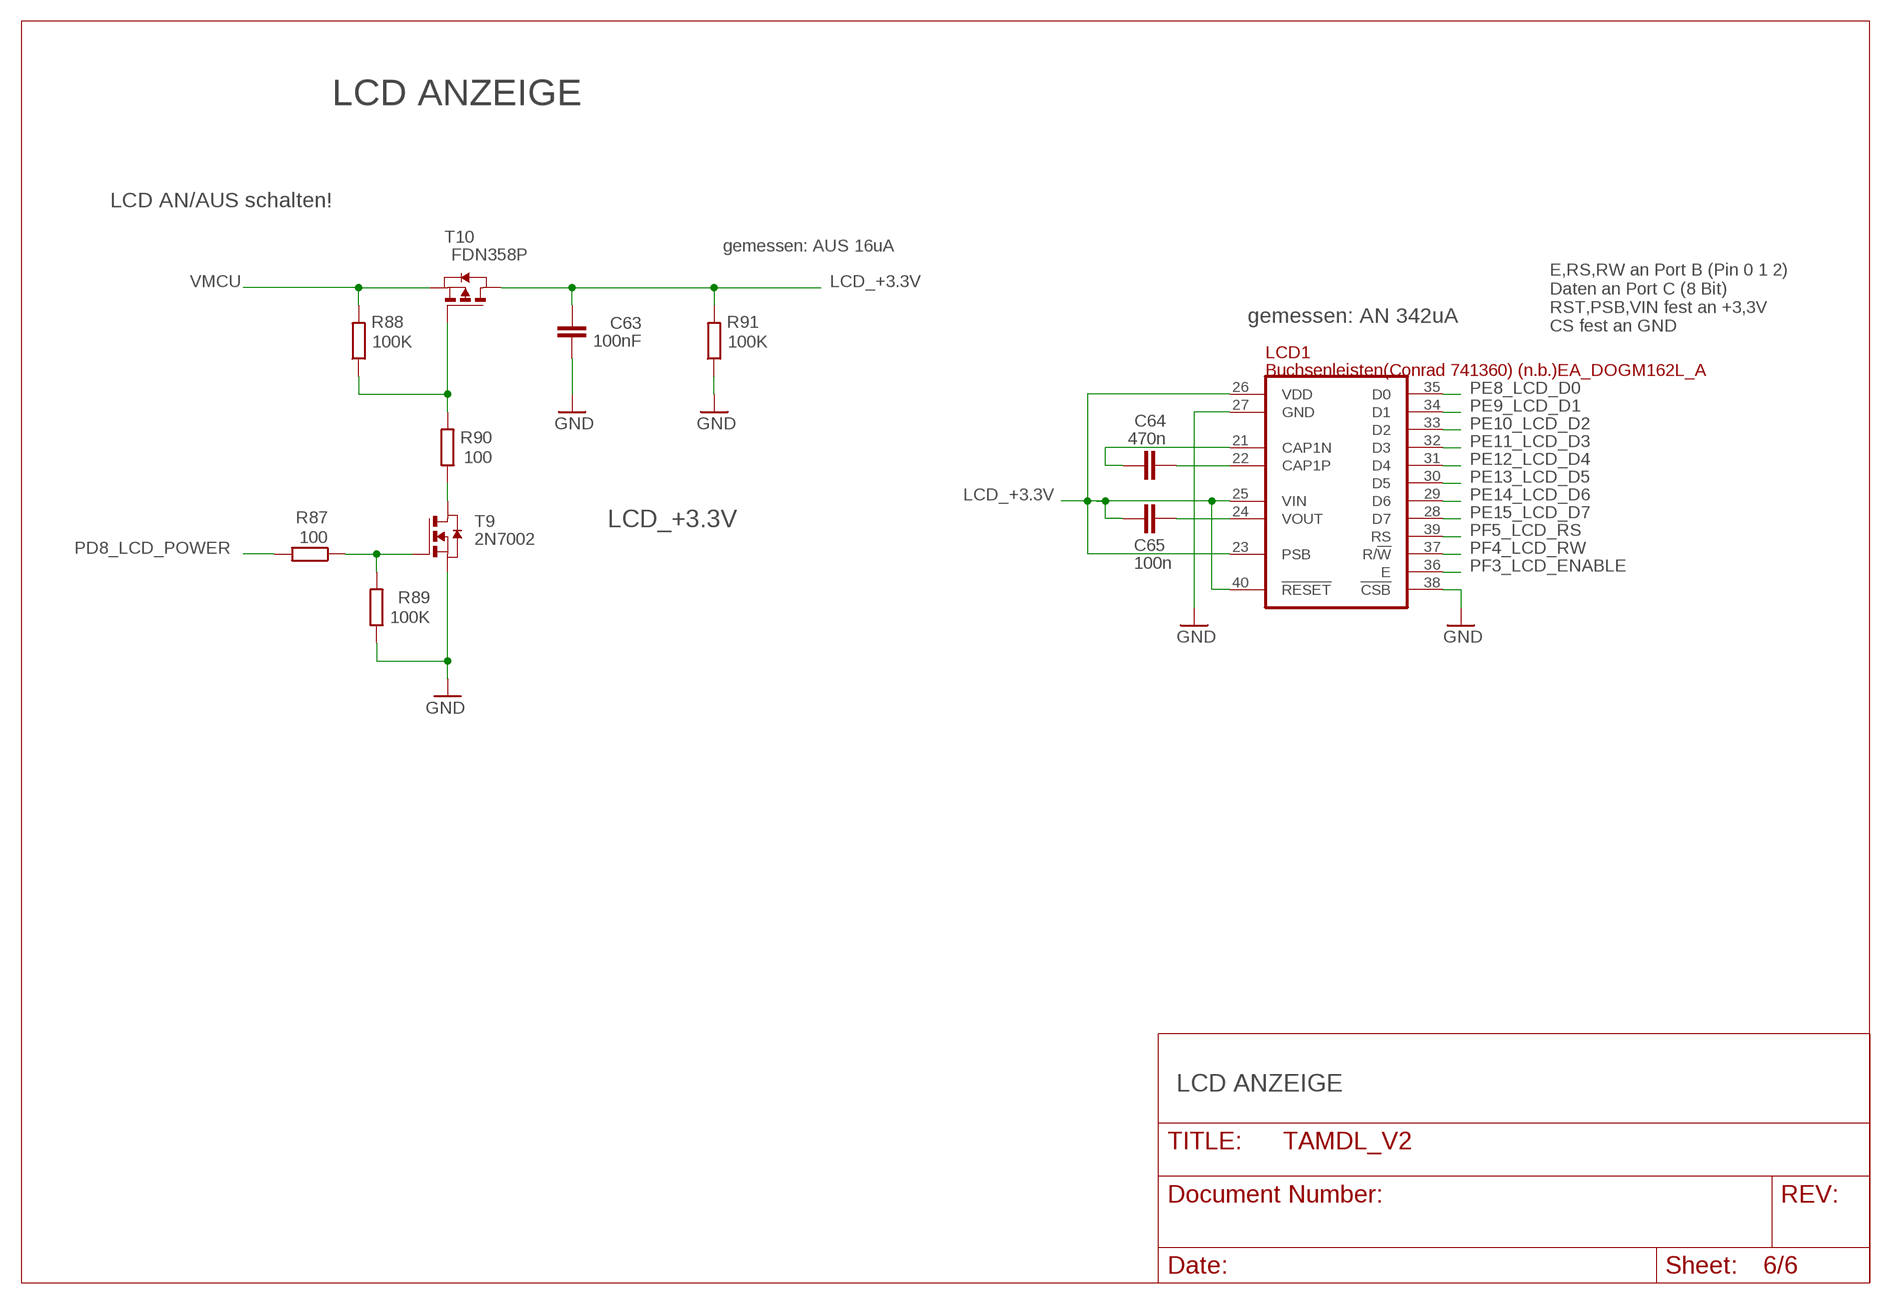
[diagram p5: schematic, sheet 6]

### Parts
C63  100nF  C-EUC0603  [C0603]
C64  470n  C-EUC0805  [C0805]
C65  100n  C-EUC1206  [C1206]
LCD1  Buchsenleisten(Conrad 741360) (n.b.)EA_DOGM162L_A  EA_DOGM162  [EA_DOGM]
R87  100  R-EU_R0805  [R0805]
R88  100K  R-EU_R0805  [R0805]
R89  100K  R-EU_R0805  [R0805]
R90  100  R-EU_R0805  [R0805]
R91  100K  R-EU_R0805  [R0805]
T9  2N7002  ZETEX_NMOSSOT23  [ZETEX_SOT-23]
T10  FDN358P  ZETEX_PMOSSOT23  [ZETEX_SOT-23]

### Nets
GND: C63.2 LCD1.27(GND) LCD1.38(!CSB!) R89.1 R91.1 T9.2(S) ; also sheet 1,2,3,4,5
LCD_+3.3V: C63.1 C65.2 LCD1.23(PSB) LCD1.25(VIN) LCD1.26(VDD) LCD1.40(!RESET!) R91.2 T10.1(D)
N$31: R88.1 R90.2 T10.3(G)
N$32: R90.1 T9.1(D)
N$34: R87.1 R89.2 T9.3(G)
N$35: C64.1 LCD1.21(CAP1N)
N$37: C64.2 LCD1.22(CAP1P)
N$39: C65.1 LCD1.24(VOUT)
PD8_LCD_POWER: R87.2 ; also sheet 2
PE8_LCD_D0: LCD1.35(D0) ; also sheet 2
PE9_LCD_D1: LCD1.34(D1) ; also sheet 2
PE10_LCD_D2: LCD1.33(D2) ; also sheet 2
PE11_LCD_D3: LCD1.32(D3) ; also sheet 2
PE12_LCD_D4: LCD1.31(D4) ; also sheet 2
PE13_LCD_D5: LCD1.30(D5) ; also sheet 2
PE14_LCD_D6: LCD1.29(D6) ; also sheet 2
PE15_LCD_D7: LCD1.28(D7) ; also sheet 2
PF3_LCD_ENABLE: LCD1.36(E) ; also sheet 2
PF4_LCD_RW: LCD1.37(R/!W!) ; also sheet 2
PF5_LCD_RS: LCD1.39(RS) ; also sheet 2
VMCU: R88.2 T10.2(S) ; also sheet 1,2,3

### Notes on the sheet
- LCD ANZEIGE
- LCD AN/AUS schalten!
- gemessen: AUS 16uA
- gemessen: AN 342uA
- E,RS,RW an Port B (Pin 0 1 2)
  Daten an Port C (8 Bit)
  RST,PSB,VIN fest an +3,3V
  CS fest an GND
- LCD_+3.3V
- LCD ANZEIGE

## Library data of the parts
C1 C5 C6 = resistor:CPOL-EU: POLARIZED CAPACITOR, European symbol
C2 C3 C7-C9 C34-C55 C64 C65 = rcl:C-EU: CAPACITOR, European symbol
C4 = EdM 2011:GOLDCAP
C10-C25 = IAR.RLC:C_SMD
C26-C33 C56-C63 = resistor:C-EU: CAPACITOR, European symbol
D1-D3 = zetex:D2A_SOT23: Dual DIODE
D4 D5 = diode:SCHOTTKY-DIODE: Schottky Diode
D6 D7 = diode:SMF5.0AT1: 200 W Transient Voltage Suppressor Source: Data sheet <http://www.onsemi.com/pub_link/Collateral/SMF5.0AT1-D.PDF>
F1-F5 = fuse:PFUF
IC1 = texas_Kiermaier:TPS62125
IC2 = EnergyMicro:EFM32G230F128: EFM32G230F128 Gecko Microcontroller in 9mm x 9mm QFN64 package
IC3 IC4 = texas:TPS54240DGQR
IC5 IC6 = LTC6102IDD-1:LTC6102IDD-1
J1 = EdM 2011:LUMBERG1502_01
L1 = inductors:LPS3008
L2 = WE-CBF:WE-CBF: SMD EMI Suppression Ferrite Beads WE-CBF - Excellent anti-EMI properties - Low DC-restistance - Impedances till 3000 ohms - Rated current up to 6 A -- Reliable Ni-Sn electrodes -- Perfect as data lined filter and for uncoupling of distribution voltage; MPN: 7427920; OC_FARNELL: 1635707; OC_NEWARK: 08P2358; PACKAGE: IND-0805; SUPPLIER: Wuerth Elektronik
L3 L4 = inductors:DR127: High Power Density, High Efficiency, Shielded Inductors Source: coiltronics_dr_series.pdf
LCD1 = ea:EA_DOGM162: ELECTRONIC ASSEMBYL GmbH EA DOGM162-A EA DOGM081-A EA DOGM163-A
LED1-LED9 = led:LED: LED OSRAM: - CHIPLED LG R971, LG N971, LY N971, LG Q971, LY Q971, LO R971, LY R971 LH N974, LH R974 LS Q976, LO Q976, LY Q976 LO Q996 - Hyper CHIPLED LW Q18S LB Q993, LB Q99A, LB R99A - SideLED LS A670, LO A670, LY A670, LG A670, LP A670 LB A673, LV A673, LT A673, LW A673 LH A674 LY A675 LS A676, LA A676, LO A676, LY A676, LW A676 LS A679, LY A679, LG A679 - Hyper Micro SIDELED® LS Y876, LA Y876, LO Y876, LY Y876 LT Y87S - SmartLED LW L88C, LW L88S LB L89C, LB L89S, LG L890 LS L89K, LO L89K, LY L89K LS L896, LA L896, LO L896, LY L896 - TOPLED LS T670, LO T670, LY T670, LG T670, LP T670 LSG T670, LSP T670, LSY T670, LOP T670, LYG T670 LG T671, LOG T671, LSG T671 LB T673, LV T673, LT T673, LW T673 LH T674 LS T676, LA T676, LO T676, LY T676, LB T676, LH T676, LSB T676, LW T676 LB T67C, LV T67C, LT T67C, LS T67K, LO T67K, LY T67K, LW E67C LS E67B, LA E67B, LO E67B, LY E67B, LB E67C, LV E67C, LT E67C LW T67C LS T679, LY T679, LG T679 LS T770, LO T770, LY T770, LG T770, LP T770 LB T773, LV T773, LT T773, LW T773 LH T774 LS E675, LA E675, LY E675, LS T675 LS T776, LA T776, LO T776, LY T776, LB T776 LHGB T686 LT T68C, LB T68C - Hyper Mini TOPLED® LB M676 - Mini TOPLED Santana® LG M470 LS M47K, LO M47K, LY M47K Source: http://www.osram.convergy.de LUXEON: - LUMILED® LXK2-PW12-R00, LXK2-PW12-S00, LXK2-PW14-U00, LXK2-PW14-V00 LXK2-PM12-R00, LXK2-PM12-S00, LXK2-PM14-U00 LXK2-PE12-Q00, LXK2-PE12-R00, LXK2-PE12-S00, LXK2-PE14-T00, LXK2-PE14-U00 LXK2-PB12-K00, LXK2-PB12-L00, LXK2-PB12-M00, LXK2-PB14-N00, LXK2-PB14-P00, LXK2-PB14-Q00 LXK2-PR12-L00, LXK2-PR12-M00, LXK2-PR14-Q00, LXK2-PR14-R00 LXK2-PD12-Q00, LXK2-PD12-R00, LXK2-PD12-S00 LXK2-PH12-R00, LXK2-PH12-S00 LXK2-PL12-P00, LXK2-PL12-Q00, LXK2-PL12-R00 Source: www.luxeon.com KINGBRIGHT: KA-3528ASYC Source: www.kingbright.com
LSP1 LSP2 = solpad:SE13: SOLDER PAD E1542, drill 1,3mm, distributor Buerklin, 07F815
PAD1 = wirepad:SMD2: SMD PAD
PASS1-PASS4 = Passermarks:ROUND_1MM
Q1 = dcdc_BB3_V0:TRANSISTOR-FET_SI7113DN
Q2 Q3 = EdM 2011:CRYSTAL2P: Quarz Crystal
R1-R5 R15-R43 R46-R91 = resistor:R-EU_: RESISTOR, European symbol
R6-R14 R44 R45 = rcl:R-EU_: RESISTOR, European symbol
S1-S6 = switch-tact:DTSM-6
SD1 = con-hirose:DM1AA-SF-PEJ
T1 T3 T5 T7 T9 = SESA:ZETEX_NMOSSOT23: MOS FET
T2 T4 T6 T8 T10 = SESA:ZETEX_PMOSSOT23: MOS FET
X1 X3 = con-phoenix-3.81:1803439
X2 = con-phoenix-3.81:1803484
X4 = con-phoenix-3.81:1803442
X5 = con-hirose_1:DP11_8DP_2DS

## Net classes
1 GND: width 0.2 mm
2 VCC: width 0.25 mm